# EAGLE design Etch_a_Sketch (EAGLE 9.6.2)
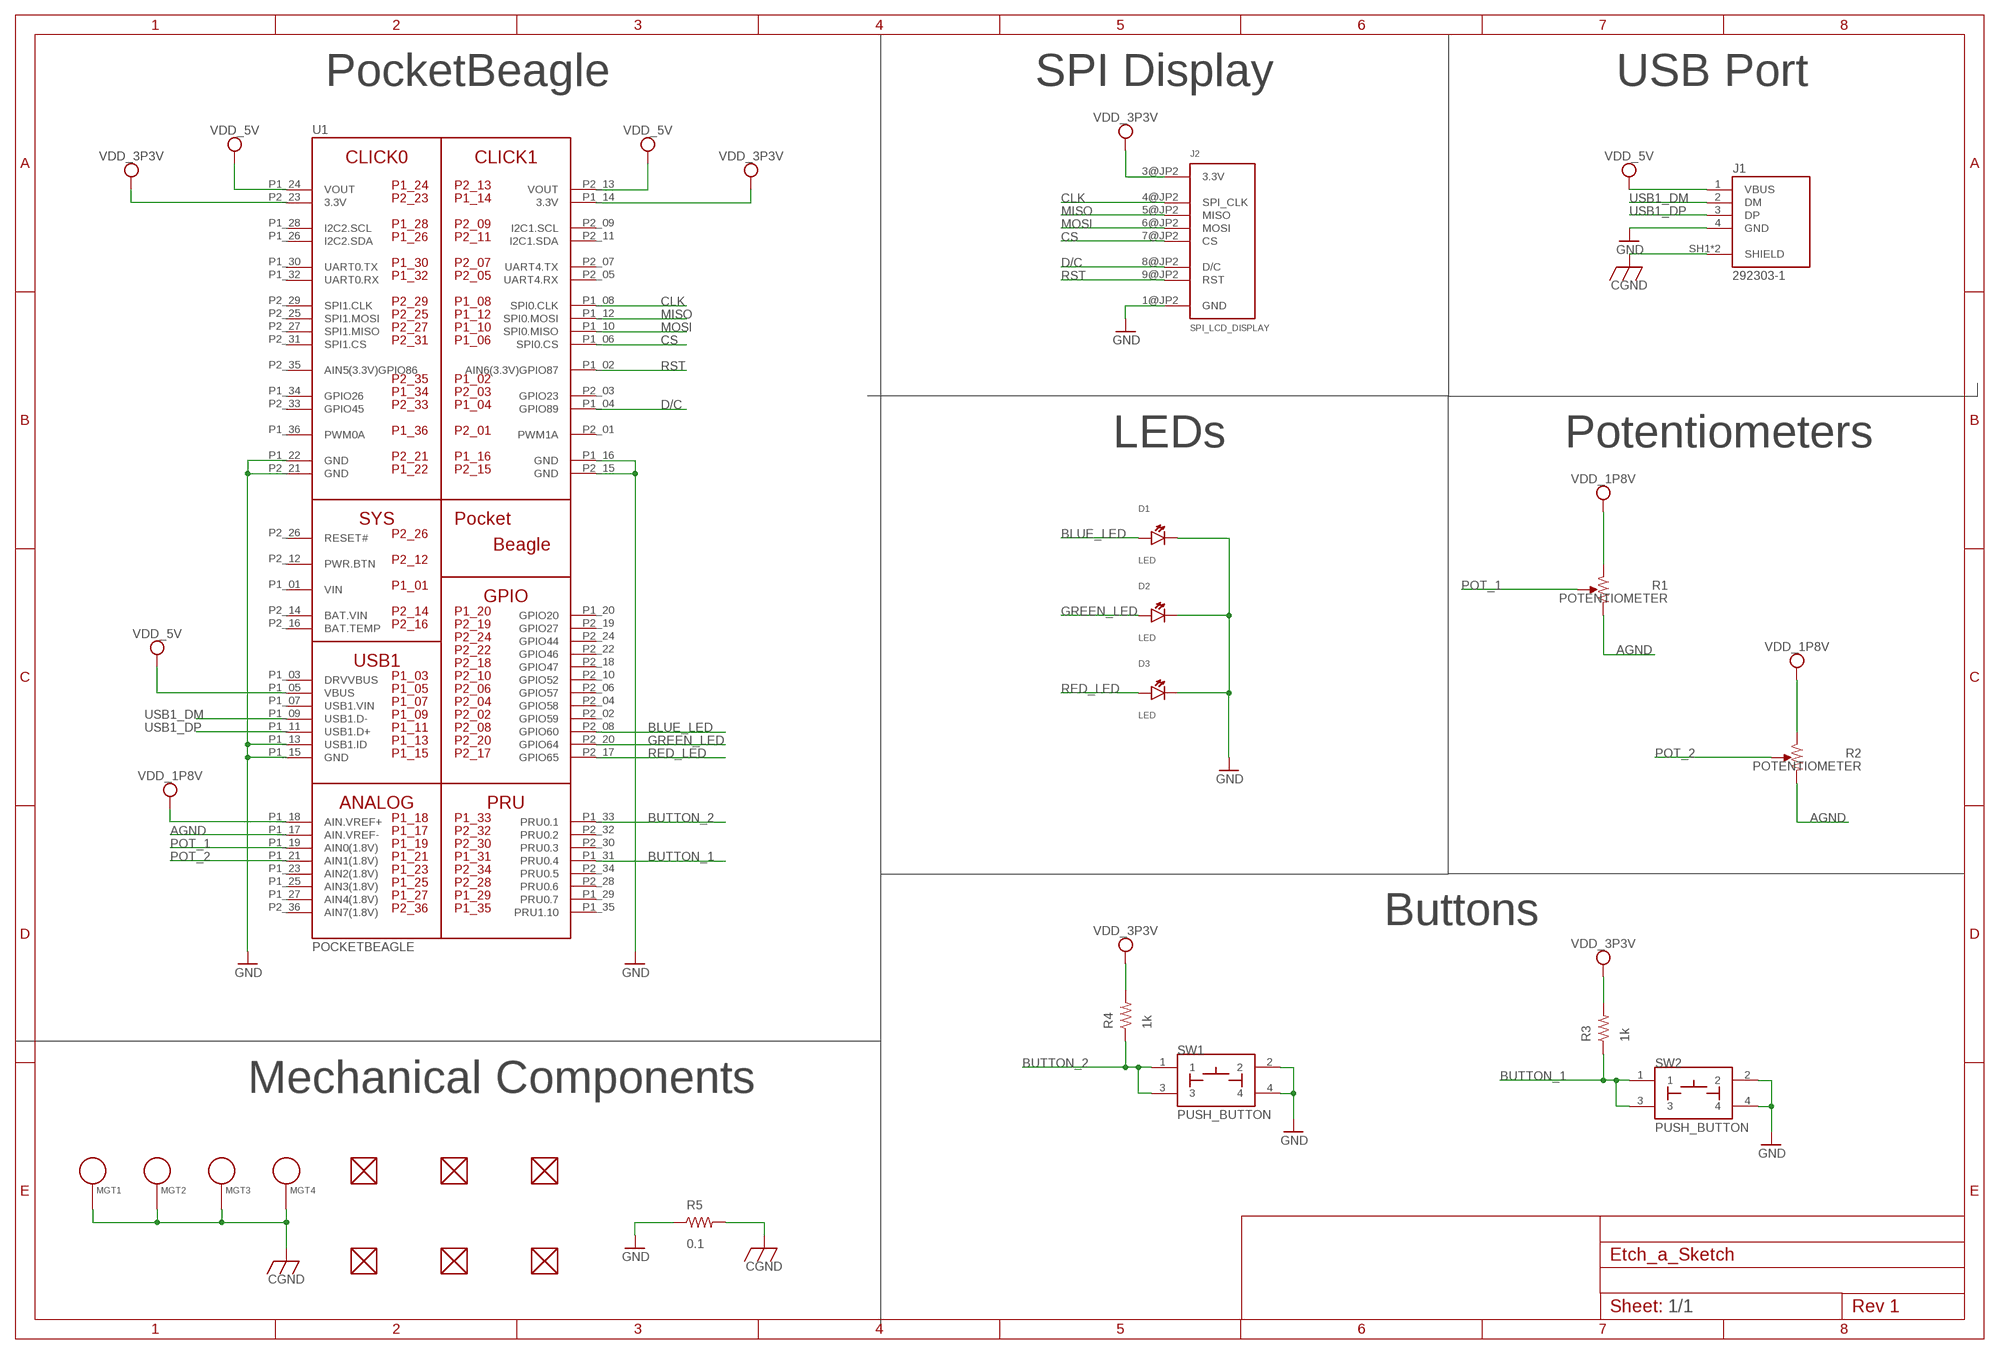
[diagram p0: schematic, sheet 1]

## Parts
D1  LED  [EIA-STD]
D2  LED  [EIA-STD]
D3  LED  [EIA-STD]
FUD1  FIDUCIAL  [FIDUCIAL_40MIL]
FUD2  FIDUCIAL  [FIDUCIAL_40MIL]
FUD3  FIDUCIAL  [FIDUCIAL_40MIL]
FUD4  FIDUCIAL  [FIDUCIAL_40MIL]
FUD5  FIDUCIAL  [FIDUCIAL_40MIL]
FUD6  FIDUCIAL  [FIDUCIAL_40MIL]
J1  292303-1  [TE_292303-1]
J2  SPI_LCD_DISPLAY  [SPI_LCD_DISPLAY]
MGT1  MOUNTING_HOLE  [MOUNTING_HOLE]
MGT2  MOUNTING_HOLE  [MOUNTING_HOLE]
MGT3  MOUNTING_HOLE  [MOUNTING_HOLE]
MGT4  MOUNTING_HOLE  [MOUNTING_HOLE]
R1  POTENTIOMETER  [POT-PO90S]
R2  POTENTIOMETER  [POT-PO90S]
R3  1k  R_R0603  [R0603]
R4  1k  R_R0603  [R0603]
R5  0.1  R_R0603  [R0603]
SW1  PUSH_BUTTON  [BUTTON_12.5MM]
SW2  PUSH_BUTTON  [BUTTON_12.5MM]
U1  POCKETBEAGLE  [POCKETBEAGLE]

## Nets
AGND: R1.CW R2.CW U1.P1_17(AIN.VREF-)
BLUE_LED: D1.ANODE U1.P2_08(GPIO60)
BUTTON_1: R3.1 SW2.1 SW2.3 U1.P1_31(PRU0.4)
BUTTON_2: R4.1 SW1.1 SW1.3 U1.P1_33(PRU0.1)
CGND: J1.SH1(SHIELD) J1.SH2(SHIELD) MGT1.P$1 MGT2.P$1 MGT3.P$1 MGT4.P$1 R5.2
CLK: J2.4@JP2(SPI_CLK) U1.P1_08(SPI0.CLK)
CS: J2.7@JP2(CS) U1.P1_06(SPI0.CS)
D/C: J2.8@JP2(D/C) U1.P1_04(GPIO89)
GND: D1.CATHODE D2.CATHODE D3.CATHODE J1.4(GND) J2.1@JP2(GND) R5.1 SW1.2 SW1.4 SW2.2 SW2.4 U1.P1_13(USB1.ID) U1.P1_15(GND) U1.P1_16(GND) U1.P1_22(GND) U1.P2_15(GND) U1.P2_21(GND)
GREEN_LED: D2.ANODE U1.P2_20(GPIO64)
MISO: J2.5@JP2(MISO) U1.P1_12(SPI0.MOSI)
MOSI: J2.6@JP2(MOSI) U1.P1_10(SPI0.MISO)
POT_1: R1.S U1.P1_19(AIN0(1.8V))
POT_2: R2.S U1.P1_21(AIN1(1.8V))
RED_LED: D3.ANODE U1.P2_17(GPIO65)
RST: J2.9@JP2(RST) U1.P1_02(AIN6(3.3V)GPIO87)
USB1_DM: J1.2(DM) U1.P1_09(USB1.D-)
USB1_DP: J1.3(DP) U1.P1_11(USB1.D+)
VDD_1P8V: R1.CCW R2.CCW U1.P1_18(AIN.VREF+)
VDD_3P3V: J2.3@JP2(3.3V) R3.2 R4.2 U1.P1_14(3.3V) U1.P2_23(3.3V)
VDD_5V: J1.1(VBUS) U1.P1_05(VBUS) U1.P1_24(VOUT) U1.P2_13(VOUT)
Unconnected: FUD1.P$1 FUD2.P$1 FUD3.P$1 FUD4.P$1 FUD5.P$1 FUD6.P$1 U1.P1_03(DRVVBUS) U1.P1_07(USB1.VIN) U1.P1_20(GPIO20) U1.P1_23(AIN2(1.8V)) U1.P1_25(AIN3(1.8V)) U1.P1_26(I2C2.SDA) U1.P1_27(AIN4(1.8V)) U1.P1_28(I2C2.SCL) U1.P1_29(PRU0.7) U1.P1_30(UART0.TX) U1.P1_32(UART0.RX) U1.P1_34(GPIO26) U1.P1_35(PRU1.10) U1.P1_36(PWM0A) U1.P2_01(PWM1A) U1.P2_02(GPIO59) U1.P2_03(GPIO23) U1.P2_04(GPIO58) U1.P2_05(UART4.RX) U1.P2_06(GPIO57) U1.P2_07(UART4.TX) U1.P2_09(I2C1.SCL) U1.P2_10(GPIO52) U1.P2_11(I2C1.SDA) U1.P2_12(PWR.BTN) U1.P2_16(BAT.TEMP) U1.P2_18(GPIO47) U1.P2_19(GPIO27) U1.P2_22(GPIO46) U1.P2_24(GPIO44) U1.P2_25(SPI1.MOSI) U1.P2_26(RESET#) U1.P2_27(SPI1.MISO) U1.P2_28(PRU0.6) U1.P2_29(SPI1.CLK) U1.P2_30(PRU0.3) U1.P2_31(SPI1.CS) U1.P2_32(PRU0.2) U1.P2_33(GPIO45) U1.P2_34(PRU0.5) U1.P2_35(AIN5(3.3V)GPIO86) U1.P2_36(AIN7(1.8V))

## Notes on the sheet
- PocketBeagle | SPI Display | USB Port
- LEDs | Potentiometers
- Buttons
- Mechanical Components
- 1/1

## Power pins joined to a net without a drawn wire
BAT.VIN: U1.P2_14(BAT.VIN)
VIN: U1.P1_01(VIN)

## Library data of the parts
D1-D3 = Etch_a_Sketch:LED: EIA-STD LED, LTST-C191TBKT
FUD1-FUD6 = Etch_a_Sketch:FIDUCIAL
J1 = Etch_a_Sketch:292303-1: CONN USB RECEPT R/A TYPE A 4POS Check availability <https://pricing.snapeda.com/parts/292303-1/TE%20Connectivity/view-part?ref=eda>; AVAILABILITY: In Stock; CENTERLINE_PITCH: 2 mm[.078 in]; COMMENT: 292303-1; DESCRIPTION: Conn; Data; USB; Recept; 2.0; 4 Pos; 1 Port; Rt Angle; A Ser; Tin over Copper; EU_ROHS_COMPLIANCE: Compliant; MF: TE Connectivity; MP: 292303-1; NUMBER_OF_POSITIONS: 4; PACKAGE: None; PRICE: None; PRODUCT_TYPE: Connector; PURCHASE-URL: https://pricing.snapeda.com/search/part/292303-1/?ref=eda
J2 = Etch_a_Sketch:SPI_LCD_DISPLAY: 2.8" Adafruit SPI Display
MGT1-MGT4 = Etch_a_Sketch:MOUNTING_HOLE: Chassis Mounting Hole w/GND connection ability
R1 R2 = Etch_a_Sketch:POTENTIOMETER: Potentiometer - Examples: P090S-14T20BR10K (987-1277-ND)
R3-R5 = Etch_a_Sketch:R_: RESISTOR, American symbol
SW1 SW2 = Etch_a_Sketch:PUSH_BUTTON
U1 = Etch_a_Sketch:POCKETBEAGLE

## Board
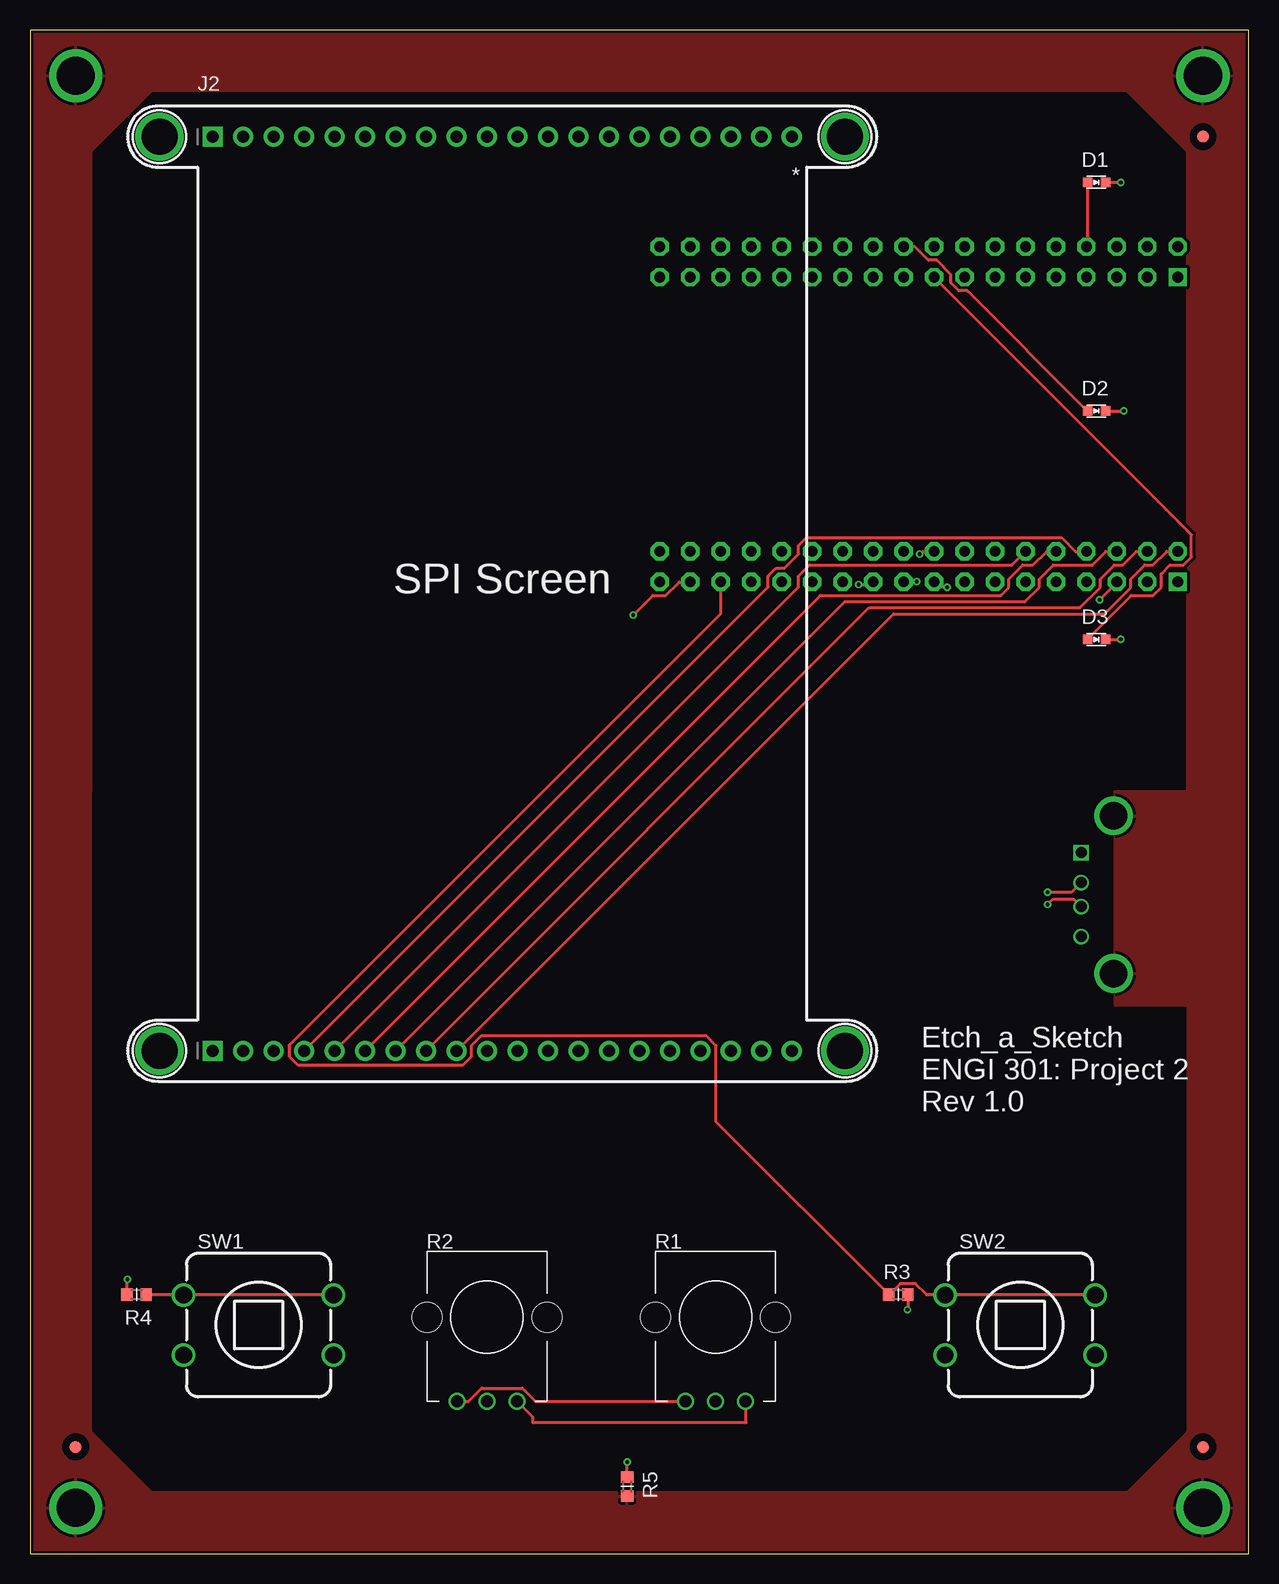
[diagram p1: board, top side]
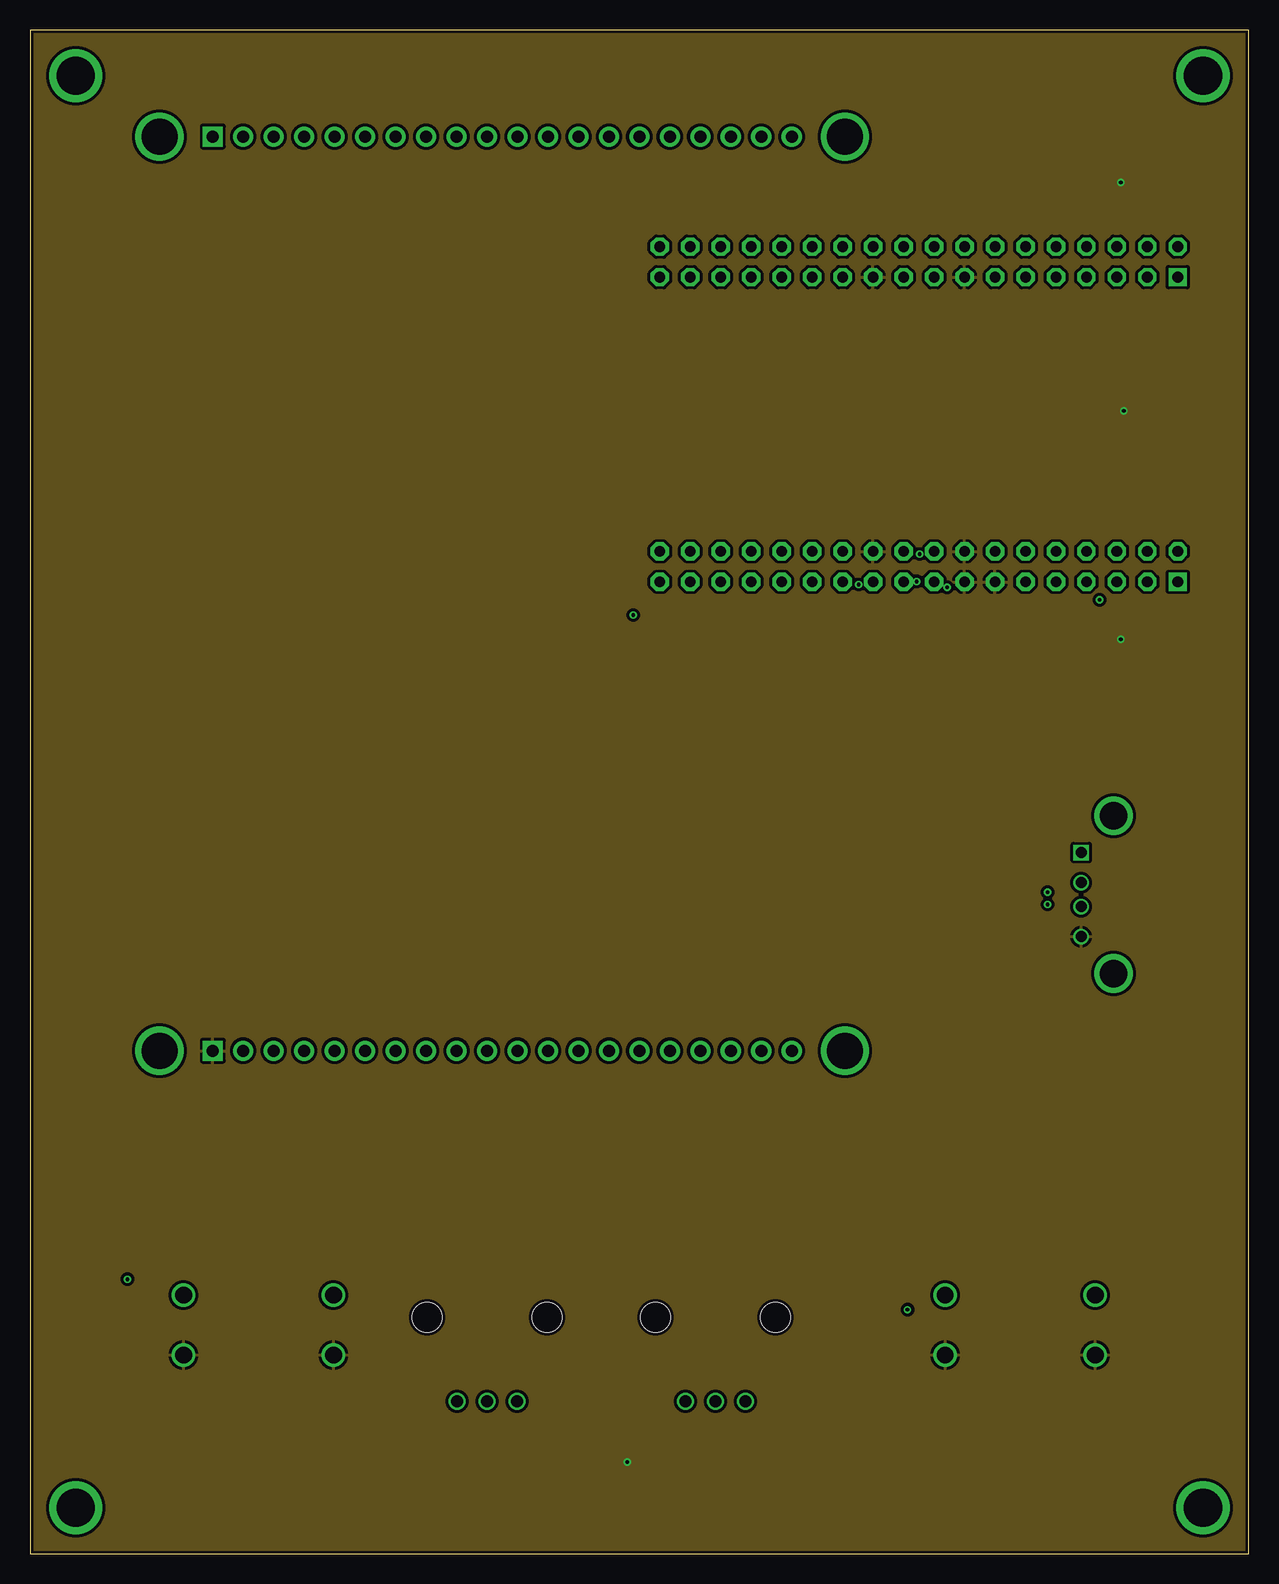
[diagram p2: board, inner layer Route2]
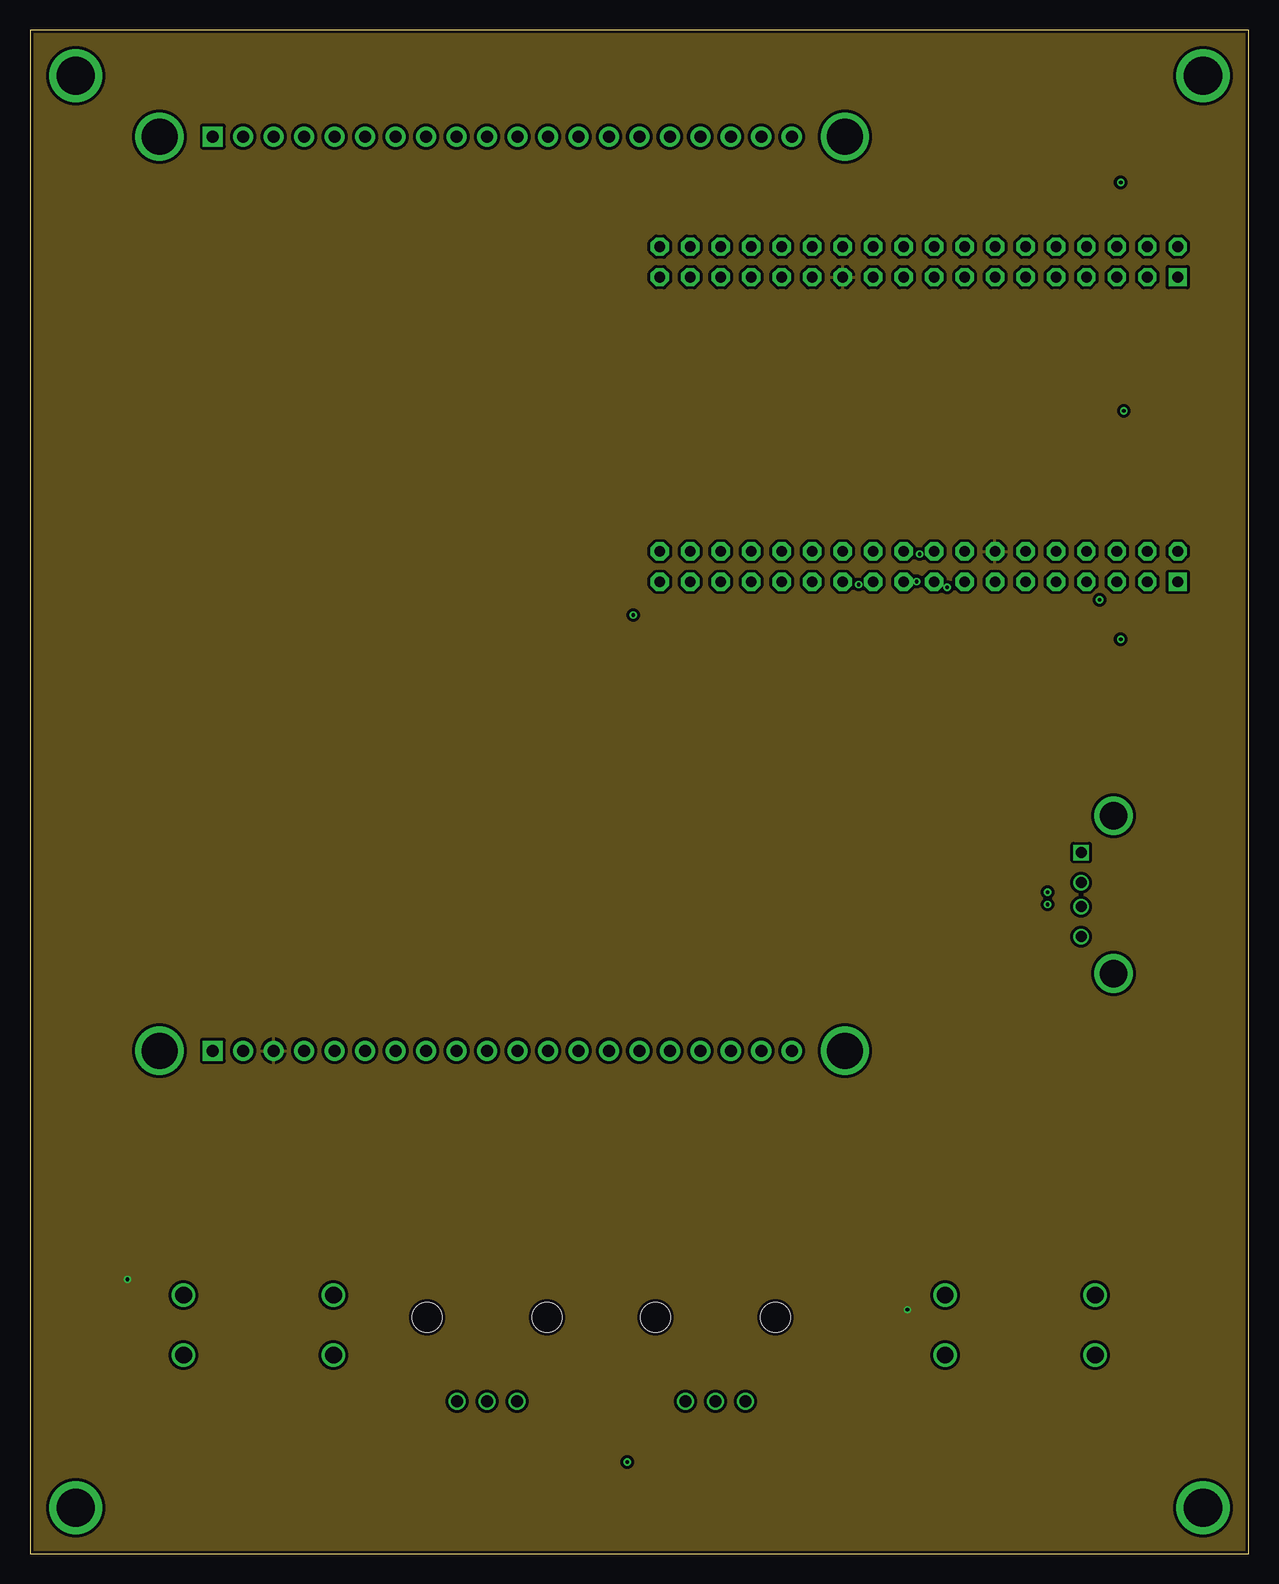
[diagram p3: board, inner layer Route15]
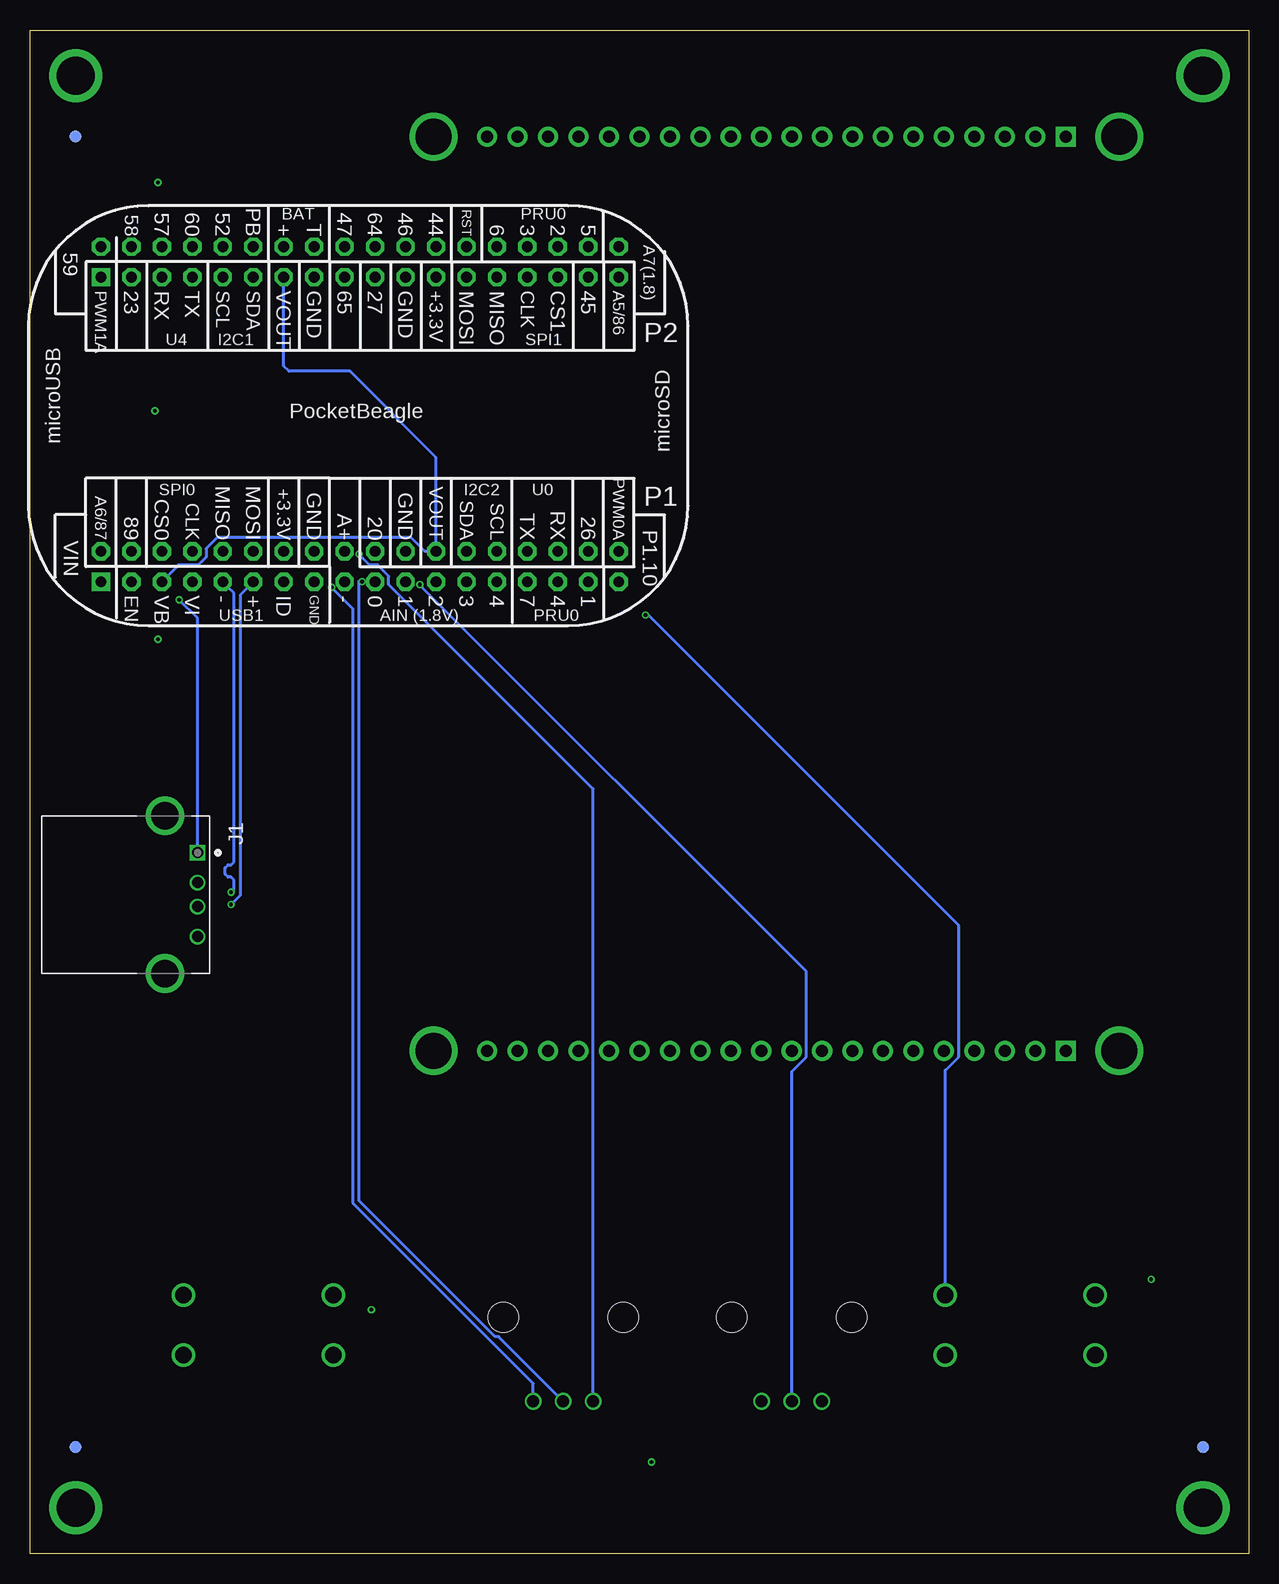
[diagram p4: board, bottom side, seen from below]

Size 101.6 x 127 mm. Coordinates in mm from the lower left corner, seen from the top.
Outline: 0,0 101.6,0 101.6,127 0,127 0,0
Copper layers (1*2*15*16): Top 0.035mm / dielectric 0.23mm / Route2 0.035mm / dielectric 0.93mm / Route15 0.035mm / dielectric 0.23mm / Bottom 0.035mm
Design rules "ENGI301_4lyr": minimum track width 10mil, minimum drill 12mil, track to track 10mil, track to pad 10mil, pad to pad 10mil, via to via 10mil, smd to smd 10mil, copper to edge 10mil, drill to drill 12mil, minimum pad ring 6mil, minimum via ring 6mil, stop-mask expansion 3mil, vias tented up to drill 25mil, thermal gap 10mil

### Footprints (pad centres in the part's own frame; a part is rotated, then mirrored left to right if it is on the bottom)
EIA-STD = smd 0.8 x 0.8: ANODE -0.75,0; CATHODE 0.75,0
FIDUCIAL_40MIL = smd 1.016 x 1.016: P$1 0,0
TE_292303-1 = drill 0.92 square: 1 0,0 | drill 0.92: 2 2.5,0; 3 4.5,0; 4 7,0 | drill 2.3: SH1 -3.07,-2.71; SH2 10.07,-2.71
SPI_LCD_DISPLAY = drill 1 pad 1.676 square: 1@JP1 -24.13,38.1; 1@JP2 -24.13,-38.1 | drill 1 pad 1.676: 2@JP1 -21.59,38.1; 2@JP2 -21.59,-38.1; 3@JP1 -19.05,38.1; 3@JP2 -19.05,-38.1; 4@JP1 -16.51,38.1; 4@JP2 -16.51,-38.1; 5@JP1 -13.97,38.1; 5@JP2 -13.97,-38.1; 6@JP1 -11.43,38.1; 6@JP2 -11.43,-38.1; 7@JP1 -8.89,38.1; 7@JP2 -8.89,-38.1; 8@JP1 -6.35,38.1; 8@JP2 -6.35,-38.1; 9@JP1 -3.81,38.1; 9@JP2 -3.81,-38.1; 10@JP1 -1.27,38.1; 10@JP2 -1.27,-38.1; 11@JP1 1.27,38.1; 11@JP2 1.27,-38.1; 12@JP1 3.81,38.1; 12@JP2 3.81,-38.1; 13@JP1 6.35,38.1; 13@JP2 6.35,-38.1; 14@JP1 8.89,38.1; 14@JP2 8.89,-38.1; 15@JP1 11.43,38.1; 15@JP2 11.43,-38.1; 16@JP1 13.97,38.1; 16@JP2 13.97,-38.1; 17@JP1 16.51,38.1; 17@JP2 16.51,-38.1; 18@JP1 19.05,38.1; 18@JP2 19.05,-38.1; 19@JP1 21.59,38.1; 19@JP2 21.59,-38.1; 20@JP1 24.13,38.1; 20@JP2 24.13,-38.1 | drill 3 pad 3.6: P$1@U$7 -28.575,-38.1; P$1@U$15 28.575,-38.1; P$1@U$16 -28.575,38.1; P$1@U$17 28.575,38.1
MOUNTING_HOLE = drill 3.175 pad 4.445: P$1 0,0
POT-PO90S = drill 1: CCW -2.5,0; CW 2.5,0; S 0,0 | hole 2.5: -5,7; 5,7
R0603 = smd 0.95 x 1.031: 1 -0.8,0; 2 0.8,0
BUTTON_12.5MM = drill 1.4: 1 -6.25,2.5; 2 -6.25,-2.5; 3 6.25,2.5; 4 6.25,-2.5
POCKETBEAGLE = drill 0.889 pad 1.524 square: P1_01 5.91,3.53; P2_01 5.91,28.93 | drill 0.889 pad 1.524 octagon: P1_02 5.91,6.07; P1_03 8.45,3.53; P1_04 8.45,6.07; P1_05 10.99,3.53; P1_06 10.99,6.07; P1_07 13.53,3.53; P1_08 13.53,6.07; P1_09 16.07,3.53; P1_10 16.07,6.07; P1_11 18.61,3.53; P1_12 18.61,6.07; P1_13 21.15,3.53; P1_14 21.15,6.07; P1_15 23.69,3.53; P1_16 23.69,6.07; P1_17 26.23,3.53; P1_18 26.23,6.07; P1_19 28.77,3.53; P1_20 28.77,6.07; P1_21 31.31,3.53; P1_22 31.31,6.07; P1_23 33.85,3.53; P1_24 33.85,6.07; P1_25 36.39,3.53; P1_26 36.39,6.07; P1_27 38.93,3.53; P1_28 38.93,6.07; P1_29 41.47,3.53; P1_30 41.47,6.07; P1_31 44.01,3.53; P1_32 44.01,6.07; P1_33 46.55,3.53; P1_34 46.55,6.07; P1_35 49.09,3.53; P1_36 49.09,6.07; P2_02 5.91,31.47; P2_03 8.45,28.93; P2_04 8.45,31.47; P2_05 10.99,28.93; P2_06 10.99,31.47; P2_07 13.53,28.93; P2_08 13.53,31.47; P2_09 16.07,28.93; P2_10 16.07,31.47; P2_11 18.61,28.93; P2_12 18.61,31.47; P2_13 21.15,28.93; P2_14 21.15,31.47; P2_15 23.69,28.93; P2_16 23.69,31.47; P2_17 26.23,28.93; P2_18 26.23,31.47; P2_19 28.77,28.93; P2_20 28.77,31.47; P2_21 31.31,28.93; P2_22 31.31,31.47; P2_23 33.85,28.93; P2_24 33.85,31.47; P2_25 36.39,28.93; P2_26 36.39,31.47; P2_27 38.93,28.93; P2_28 38.93,31.47; P2_29 41.47,28.93; P2_30 41.47,31.47; P2_31 44.01,28.93; P2_32 44.01,31.47; P2_33 46.55,28.93; P2_34 46.55,31.47; P2_35 49.09,28.93; P2_36 49.09,31.47

### Placement (x,y rotation side)
D1  88.9,114.3 0 top
D2  88.9,95.25 0 top
D3  88.9,76.2 0 top
FUD1  3.81,8.89 90 top
FUD2  97.79,8.89 90 top
FUD3  3.81,8.89 90 bottom
FUD4  97.79,8.89 90 bottom
FUD5  97.79,118.11 90 bottom
FUD6  97.79,118.11 90 top
J1  87.63,58.42 270 bottom
J2  39.37,80.01 0 top
MGT1  3.81,123.19 90 top
MGT2  3.81,3.81 90 top
MGT3  97.79,3.81 90 top
MGT4  97.79,123.19 90 top
R1  57.15,12.7 0 top
R2  38.1,12.7 0 top
R3  72.39,21.59 0 top
R4  8.89,21.59 180 top
R5  49.78,5.59 270 top
SW1  19.05,19.05 0 top
SW2  82.55,19.05 0 top
U1  101.6,77.47 0 bottom

### Tracks (layer width: path | path; a pad name or v marks a point on that pad's centre or on a via)
AGND  (via drill 0.3 pad 0.61)
  Top 0.254: R2.CW 41.91,11.39 41.91,10.92 59.69,10.92 59.69,12.66 R1.CW | v76.45,80.54 75.83,80.54 U1.P1_17
  Bottom 0.254: R1.CW 59.65,14.18 74.68,29.2 74.68,78.74 76.45,80.52 v76.45,80.54
BLUE_LED
  Top 0.254: D1.ANODE 88.15,109.02 U1.P2_08
BUTTON_1
  Top 0.254: SW2.3 SW2.1 74.76,21.55 73.82,22.49 72.56,22.49 71.66,21.59 R3.1 57.2,35.98 57.2,42.31 56.38,43.13 37.59,43.13 36.78,42.31 36.78,41.41 36.06,40.69 22.36,40.69 21.64,41.41 21.64,42.41 57.59,78.36 U1.P1_31
BUTTON_2  (via drill 0.3 pad 0.61)
  Top 0.254: v50.29,78.23 51.92,79.86 52.98,79.86 54.13,81 U1.P1_33 | R4.1 9.73,21.55 SW1.1 SW1.3
  Bottom 0.254: SW1.3 25.3,40.29 24.18,41.41 24.18,52.38 50.04,78.23 v50.29,78.23
CGND
  pour Top: -2.54,63.5 -2.54,-2.54 104.14,-2.54 104.14,63.5 90.42,63.5 90.42,45.72 96.52,45.72 96.52,10.16 91.44,5.08 10.16,5.08 5.08,10.16 5.08,63.5
  pour Top: -2.54,63.5 -2.54,129.54 104.14,129.54 104.14,63.5 96.52,63.5 96.52,116.84 91.44,121.92 88.9,121.92 10.16,121.92 5.08,116.84 5.08,63.5
CLK
  Top 0.254: J2.4@JP2 61.53,80.58 61.53,81.47 62.2,82.14 62.89,82.14 64.07,83.32 64.07,84.01 64.74,84.68 86,84.68 87.15,83.54 U1.P1_08
CS
  Top 0.254: J2.7@JP2 67.92,79.35 82.95,79.35 84.13,80.53 84.13,81.22 85.31,82.4 88.54,82.4 89.69,83.54 U1.P1_06
D/C
  Top 0.254: J2.8@JP2 69.95,78.84 87.53,78.84 89.21,80.53 89.21,81.22 90.39,82.4 91.08,82.4 92.23,83.54 U1.P1_04
GND  (via drill 0.3 pad 0.61)
  Top 0.254: D1.CATHODE v90.93,114.3 | D2.CATHODE v91.19,95.25 | R5.1 v49.78,7.62 | D3.CATHODE v90.93,76.2
  pour Route2: -5.08,132.08 106.68,132.08 106.68,-5.08 -5.08,-5.08
GREEN_LED
  Top 0.254: D2.ANODE 78.14,105.26 77.44,105.26 76.77,105.93 76.77,106.62 75.59,107.8 74.9,107.8 73.75,108.94 U1.P2_20
MISO
  Top 0.254: J2.5@JP2 64.07,80.58 64.07,81.47 64.99,82.4 81.85,82.4 U1.P1_12
MOSI
  Top 0.254: J2.6@JP2 65.89,79.86 80.92,79.86 81.59,80.53 81.59,81.22 82.77,82.4 83.62,82.4 84.77,83.54 U1.P1_10
POT_1  (via drill 0.3 pad 0.61)
  Top 0.254: v73.91,81.03 73.89,81 U1.P1_19
  Bottom 0.254: R1.S 62.52,18.07 62.83,18.07 74.17,29.41 74.17,81.03 v73.91,81.03
POT_2  (via drill 0.3 pad 0.61)
  Top 0.254: v69.09,80.77 70.06,80.77 U1.P1_21
  Bottom 0.254: R2.S 38.1,40.19 36.88,41.41 36.88,48.51 68.89,80.53 68.89,80.77 v69.09,80.77
RED_LED
  Top 0.254: D3.ANODE 91.81,79.86 93.62,79.86 94.29,80.53 94.29,81.67 95.02,82.4 96.16,82.4 96.83,83.07 96.83,84.94 U1.P2_17
RST
  Top 0.254: J2.9@JP2 71.98,78.33 89.56,78.33 91.75,80.53 91.75,81.22 92.93,82.4 93.62,82.4 94.77,83.54 U1.P1_02
USB1_DM  (via drill 0.3 pad 0.61)
  Top 0.254: J1.2 86.83,55.12 v84.84,55.12
  Bottom 0.254: U1.P1_09 85.07,80.54 84.58,80.05 84.58,57.66 84.84,57.4 85.09,57.4 85.34,57.15 85.34,56.64 85.09,56.39 84.84,56.39 84.58,56.13 84.58,55.37 v84.84,55.12
USB1_DP  (via drill 0.3 pad 0.61)
  Top 0.254: v84.84,54.1 85.24,54.51 87.04,54.51 J1.3
  Bottom 0.254: U1.P1_11 84.07,79.92 84.07,54.86 v84.84,54.1
VDD_1P8V  (via drill 0.3 pad 0.61)
  Top 0.254: v74.17,83.31 74.4,83.54 U1.P1_18 | R2.CCW 36.57,12.7 37.65,13.78 41.05,13.78 42.13,12.7 R1.CCW
  Bottom 0.254: v74.17,83.31 74.17,83.26 73.3,82.4 72.61,82.4 71.69,81.47 71.69,80.78 54.65,63.74 R1.CCW
VDD_3P3V  (via drill 0.3 pad 0.61)
  Top 0.254: R4.2 8.09,22.82 v8.13,22.86 | R3.2 73.19,20.32 v73.15,20.32
  pour Route15: -7.62,134.62 109.22,134.62 109.22,-7.62 -7.62,-7.62
VDD_5V  (via drill 0.3 pad 0.61)
  Top 0.254: v89.16,79.5 90.61,80.95 U1.P1_05
  Bottom 0.254: U1.P2_13 80.45,98.99 80.01,98.55 74.93,98.55 67.75,91.37 U1.P1_24 68.67,83.54 69.82,84.68 86,84.68 86.93,83.76 86.93,83.07 87.6,82.4 89.21,82.4 U1.P1_05 | J1.1 87.63,77.97 v89.16,79.5

### Text on the board
tPlace: Etch_a_Sketch / ENGI 301: Project 2 / Rev 1.0